# Altium schematic sheet Selection.SchDoc
size A4; SheetNumber: 7; SheetTotal: 7
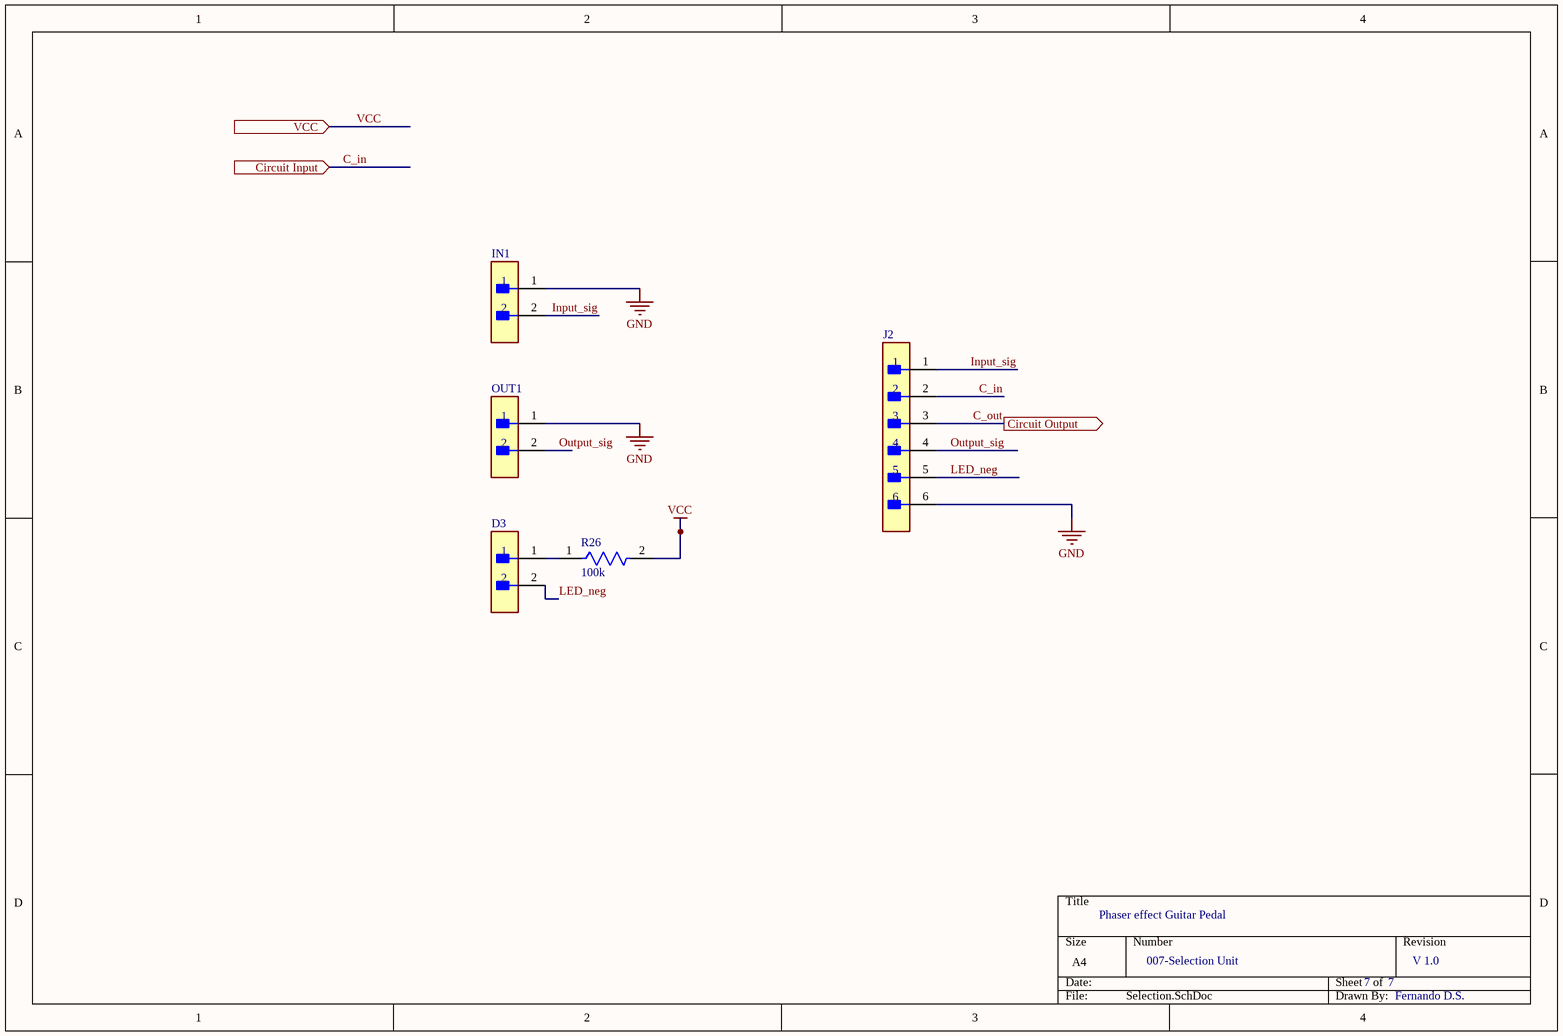
[diagram p0: Selection.SchDoc]

## Parts
D3  B2B-EH-A(LF)(SN)  [FP-B2B-EH-A_LF_SN-MFG]  (value not drawn)
IN1  B2B-EH-A(LF)(SN)  [FP-B2B-EH-A_LF_SN-MFG]  (value not drawn)
J2  B6B-XH-A(LF)(SN)  [FP-B6B-XH-A_LF_SN-MFG]  (value not drawn)
OUT1  B2B-EH-A(LF)(SN)  [FP-B2B-EH-A_LF_SN-MFG]  (value not drawn)
R26  100k  [FP-MRS25-MFG]

## Ports
Circuit Input (in, see Main[2C]), Circuit Output (out, see Main[3C]), VCC (in, see Main[2D], Input Buffer[1A], LFO[1A], Phase Shifting Stage[1A], Power supply[3B])

## Nets
GND: IN1.1 J2.6 OUT1.1
VCC: R26.2 ; port VCC
C_in: J2.2 ; port Circuit Input
C_out: J2.3 ; port Circuit Output
Input_sig: IN1.2 J2.1
LED_neg: D3.2 J2.5
Output_sig: J2.4 OUT1.2
NetD3_1: D3.1 R26.1

## Notes on the sheet
- Phaser effect Guitar Pedal
- 007-Selection Unit
- 7
- V 1.0
- Fernando D.S.

## Library data of the parts
D3 = CMP-17439-000026-1: CONN HEADER VERT 2POS 2.5MM; Number of Contacts: 2; Current Rating: 3A; Connector Type: Plug; Contact Resistance: 20mR; Gender: Male; Voltage Rating: 250V; Color: Natural; Fastening Type: Detent; Depth: 3.8mm; Max Operating Temperature: 85°C; Orientation: Straight; Series: EH; Contact Plating: Tin; Min Operating Temperature: -25°C; Contact Type: Male Pin; Housing Color: White; Termination: Press-Fit; Housing Material: Nylon; Pitch: 2.5mm; Number of Positions: 2; Max Current Rating: 3A; Packaging: Bulk; Lead Free: Lead Free; Number of Rows: 1; Length: 7.5mm; Contact Mating Length: 0.13inch; Max Voltage Rating (AC): 250V; Contact Material: Copper Alloy; Mount: Through Hole
IN1 OUT1 = CMP-17439-000026-1: CONN HEADER VERT 2POS 2.5MM; Number of Contacts: 2; Current Rating: 3A; Connector Type: Plug; Contact Resistance: 20mR; Gender: Male; Voltage Rating: 250V; Fastening Type: Detent; Depth: 3.8mm; Max Operating Temperature: 85°C; Orientation: Straight; Series: EH; Contact Plating: Tin; Min Operating Temperature: -25°C; Contact Type: Male Pin; Housing Color: White; Termination: Press-Fit; Housing Material: Nylon; Pitch: 2.5mm; Number of Positions: 2; Max Current Rating: 3A; Packaging: Bulk; Lead Free: Lead Free; Number of Rows: 1; Length: 7.5mm; Contact Mating Length: 0.13inch; Color: Natural; Max Voltage Rating (AC): 250V; Contact Material: Copper Alloy; Mount: Through Hole
J2 = CMP-17439-000076-1: CONN HEADER VERT 6POS 2.5MM
R26 = CMP-00030-42757237-1: MRS25000C1000FRP00 Resistor, 100 Ohm, ± 1%, 600 mW, Axial Leaded, Metal Film (Thin Film), Professional; Max Power Dissipation: 600mW; Resistance: 100Ω; Voltage Rating: 350V; Temperature Coefficient: 50ppm/°C; Lead Diameter: 600µm; RoHS: Compliant; Radiation Hardening: No; Schedule B: 8533210090, 8533210090; Length: 6.5mm; Packaging: Tape & Reel (TR); Number of Terminations: 2; Mount: Through Hole; Width: 2.5mm; Tolerance: 1%; Military Standard: Not; Voltage Rating (DC): 350V; Contact Plating: Tin; Number of Pins: 2; Max Operating Temperature: 155°C; NexarPartId: 42757237; Diameter: 2.5mm; Composition: Metal Film, Thin Film; REACH SVHC: Unknown; Power Rating: 600mW; Lead Free: Lead Free; Termination: Axial; Case/Package: Axial; Min Operating Temperature: -55°C